# EAGLE design mains_relay_modem (EAGLE 7.5.0)
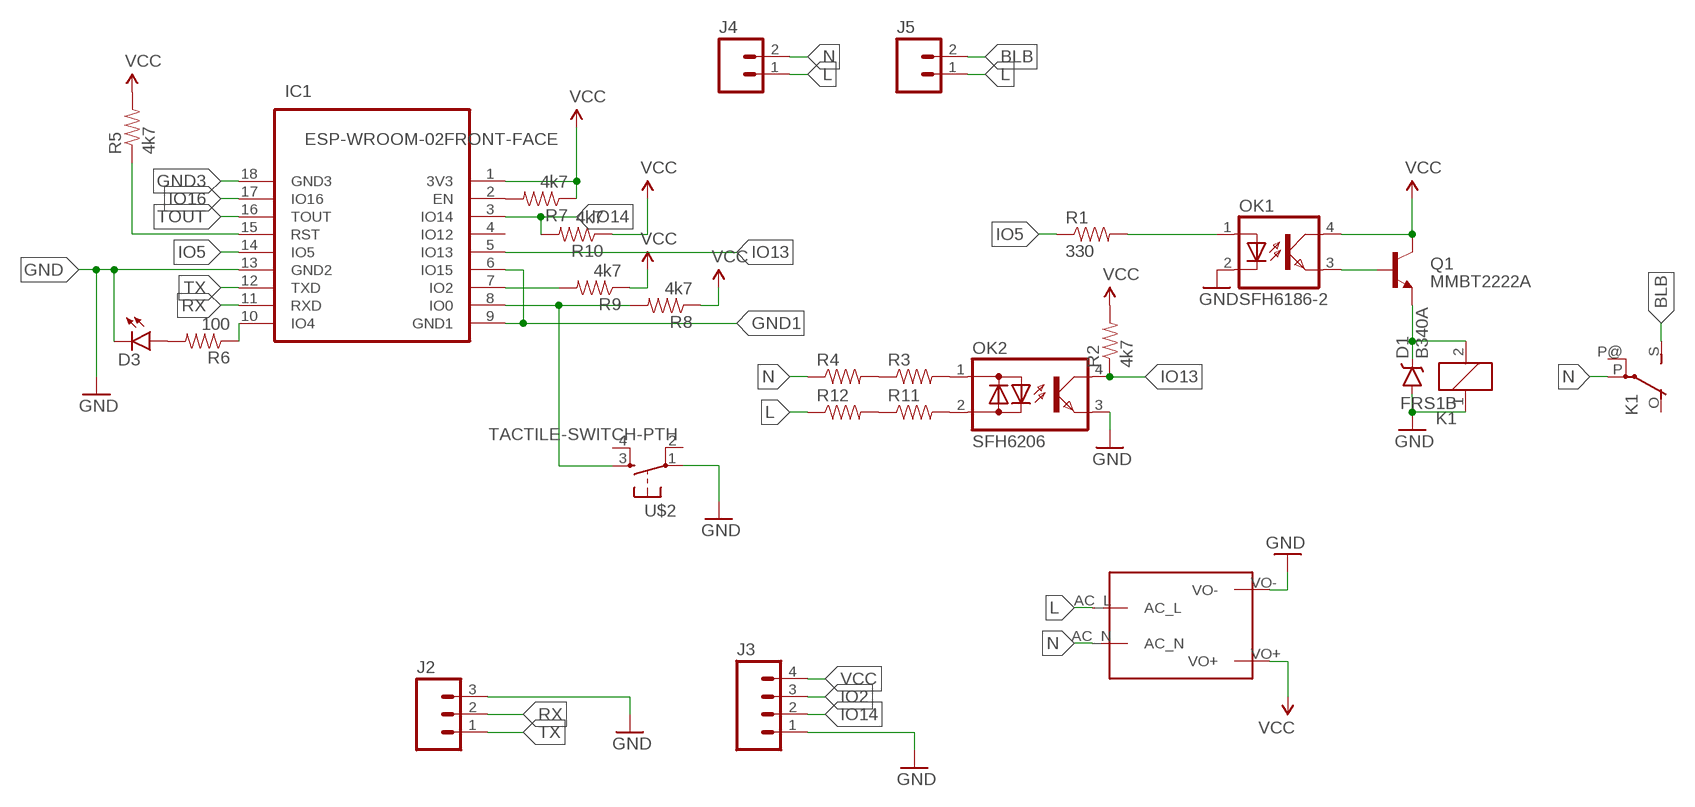
[diagram p0: schematic, sheet 1]

## Parts
D1  B340A  DIODE-SCHOTTKY-B340A  [SMA-DIODE]
D3  LED3MM  [LED3MM]
IC1  ESP-WROOM-02FRONT-FACE  [FRONT-FACE]
J2  M03PTH  [1X03]
J3  M04NO_SILK_ALL_ROUND  [1X04_NO_SILK_ALL_ROUND]
J4  M025MM  [SCREWTERMINAL-5MM-2]
J5  M025MM  [SCREWTERMINAL-5MM-2]
K1  FRS1B  [FRS1B]
OK1  SFH6186-2  [SMD4]
OK2  SFH6206  [DIL4-SMD]
Q1  MMBT2222A  TRANSISTOR_NPNMMBT2222A  [SOT23-3]
R1  330  RESISTOR0805-RES  [0805]
R2  4k7  RESISTOR0805-RES  [0805]
R3  RESISTOR0805-RES  [0805]
R4  RESISTOR0805-RES  [0805]
R5  4k7  RESISTOR0805-RES  [0805]
R6  100  RESISTOR0805-RES  [0805]
R7  4k7  RESISTOR0805-RES  [0805]
R8  4k7  RESISTOR0805-RES  [0805]
R9  4k7  RESISTOR0805-RES  [0805]
R10  4k7  RESISTOR0805-RES  [0805]
R11  RESISTOR0805-RES  [0805]
R12  RESISTOR0805-RES  [0805]
U$1  MAINS_CONVERTERS  [HLK-PM01]
U$2  TACTILE-SWITCH-PTH  [TAC-SWITCH-PTH]

## Nets
BLB: J5.2 K1.S(2:S)
GND: D1.A D3.K(C) IC1.13(GND2) J2.3 J3.1 K1.1 OK1.2(C) OK2.3(E) U$1.VO- U$2.1
GND1: IC1.6(IO15) IC1.9(GND1)
GND3: IC1.18(GND3)
IO2: IC1.7(IO2) J3.3 R9.2
IO5: IC1.14(IO5) R1.1
IO13: IC1.5(IO13) OK2.4(C) R2.1
IO14: IC1.3(IO14) J3.2 R10.2
IO16: IC1.17(IO16)
L: J4.1 J5.1 R12.1 U$1.AC_L
N: J4.2 K1.P(2:P) R4.1 U$1.AC_N
N$1: IC1.10(IO4) R6.1
N$2: D3.A R6.2
N$3: IC1.2(EN) R7.2
N$4: D1.C K1.2 Q1.2(E)
N$5: OK2.1(AC1) R3.2
N$6: R3.1 R4.2
N$7: OK1.1(A) R1.2
N$8: OK1.3(EMIT) Q1.1(B)
N$9: OK2.2(AC2) R11.2
N$10: IC1.15(RST) R5.1
N$11: IC1.8(IO0) R8.2 U$2.3
N$12: R11.1 R12.2
RX: IC1.11(RXD) J2.2
TOUT: IC1.16(TOUT)
TX: IC1.12(TXD) J2.1
VCC: IC1.1(3V3) J3.4 OK1.4(COL) Q1.3(C) R2.2 R5.2 R7.1 R8.1 R9.1 R10.1 U$1.VO+
Unconnected: IC1.4(IO12) K1.O(2:O) K1.P@(2:P) U$2.2 U$2.4

## Library data of the parts
D1 = SparkFun-DiscreteSemi:DIODE-SCHOTTKY: Schottky diodes in SFE's production catalog BAT20J 1A 23V 0.62Vf RB751 120mA 40V 0.37Vf PMEG4005EJ 0.5A 40V 0.42Vf MBRA140 1A 40V 0.5Vf B340A 3A 40V SMA; PROD_ID: DIO-09886
D3 = SparkFun-LED:LED: LEDs Standard schematic elements and footprints for 5mm, 3mm, 1206, and 0603 sized LEDs. 5mm - Spark Fun Electronics SKU : COM-00529 (and others); PROD_ID: DIO-08794
IC1 = esp-wroom-02:ESP-WROOM-02: WiFi module - ESP-WROOM-02
J2 = SparkFun-Connectors:M03: Header 3 Standard 3-pin 0.1" header. Use with straight break away headers (SKU : PRT-00116), right angle break away headers (PRT-00553), swiss pins (PRT-00743), machine pins (PRT-00117), and female headers (PRT-00115). Molex polarized connector foot print use with SKU : PRT-08232 with associated crimp pins and housings.
J3 = SparkFun-Connectors:M04: Header 4 Standard 4-pin 0.1" header. Use with straight break away headers (SKU : PRT-00116), right angle break away headers (PRT-00553), swiss pins (PRT-00743), machine pins (PRT-00117), and female headers (PRT-00115). Molex polarized connector foot print use with SKU : PRT-08231 with associated crimp pins and housings. 1MM SMD Version SKU: PRT-10208; PROD_ID: CONN-09696
J4 J5 = SparkFun-Connectors:M02: Standard 2-pin 0.1" header. Use with - straight break away headers ( PRT-00116) - right angle break away headers (PRT-00553) - swiss pins (PRT-00743) - machine pins (PRT-00117) - female headers (PRT-00115) Molex polarized connector foot print use with: PRT-08233 with associated crimp pins and housings. 2.54_SCREWTERM for use with PRT-10571. 3.5mm Screw Terminal footprints for PRT-08084 5mm Screw Terminal footprints for use with PRT-08432; STOREFRONT_ID: PRT-08432
K1 = relay:FRS1B: RELAY 1 x switch, same as V23101-D6-A201, Siemens; OC_FARNELL: unknown; OC_NEWARK: unknown
OK1 = optodevices:SFH618?*: Optocoupler, Phototransistor Output, Low Input Current Source: http://www.vishay.com/docs/83673/sfh618.pdf
OK2 = optodevices:SFH620: Optocoupler, Phototransistor Output, AC Input Source: http://www.vishay.com/docs/83675/sfh620.pdf
Q1 = SparkFun-DiscreteSemi:TRANSISTOR_NPN: Generic NPN BJT MMBT2222A - TRANS-08049 (SOT-23, 1A 40V) MPSA42 - TRANS-09116 (SOT-23, 500mA 300V) MMBT5088LT1G - TRANS-11160 (SOT-23, 50 mA 30V) BC547 - COM-08928 <http://www.sparkfun.com/products/8928> (TO-92 45V 100mA) (1.Collector 2.Base 3.Emitter) 2N3904 - COM-00521 <http://www.sparkfun.com/products/521> (TO-92 40V 200mA) (1.Emitter 2.Base 3.Collector) P2N2222A - COM-12852 <http://www.sparkfun.com/products/12852> (TO-92 40V 600mA) (1.Collector 2.Base 3.Emitter); PROD_ID: TRANS-08049
R1-R12 = SparkFun-Passives:RESISTOR: Resistor Basic schematic elements and footprints for 0603, 1206, and PTH resistors.
U$1 = captain-slow:MAINS_CONVERTERS
U$2 = GeekAmmo:TACTILE-SWITCH: Tactile Switch 4 Pins, SPST NO

## Board
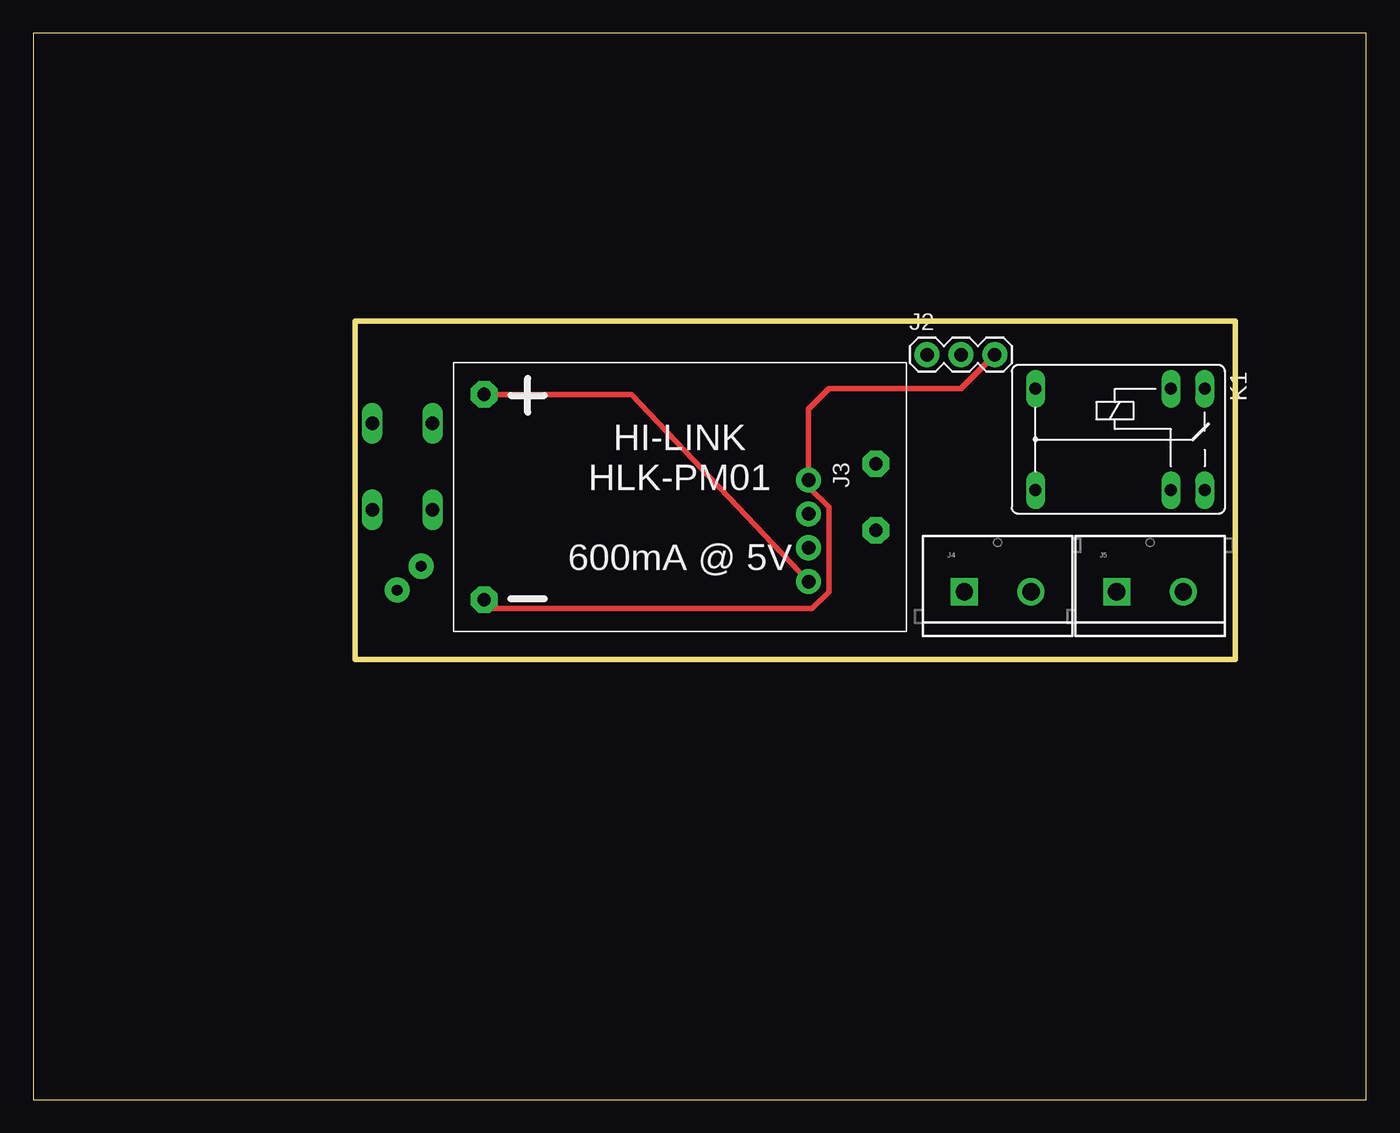
[diagram p1: board, top side]
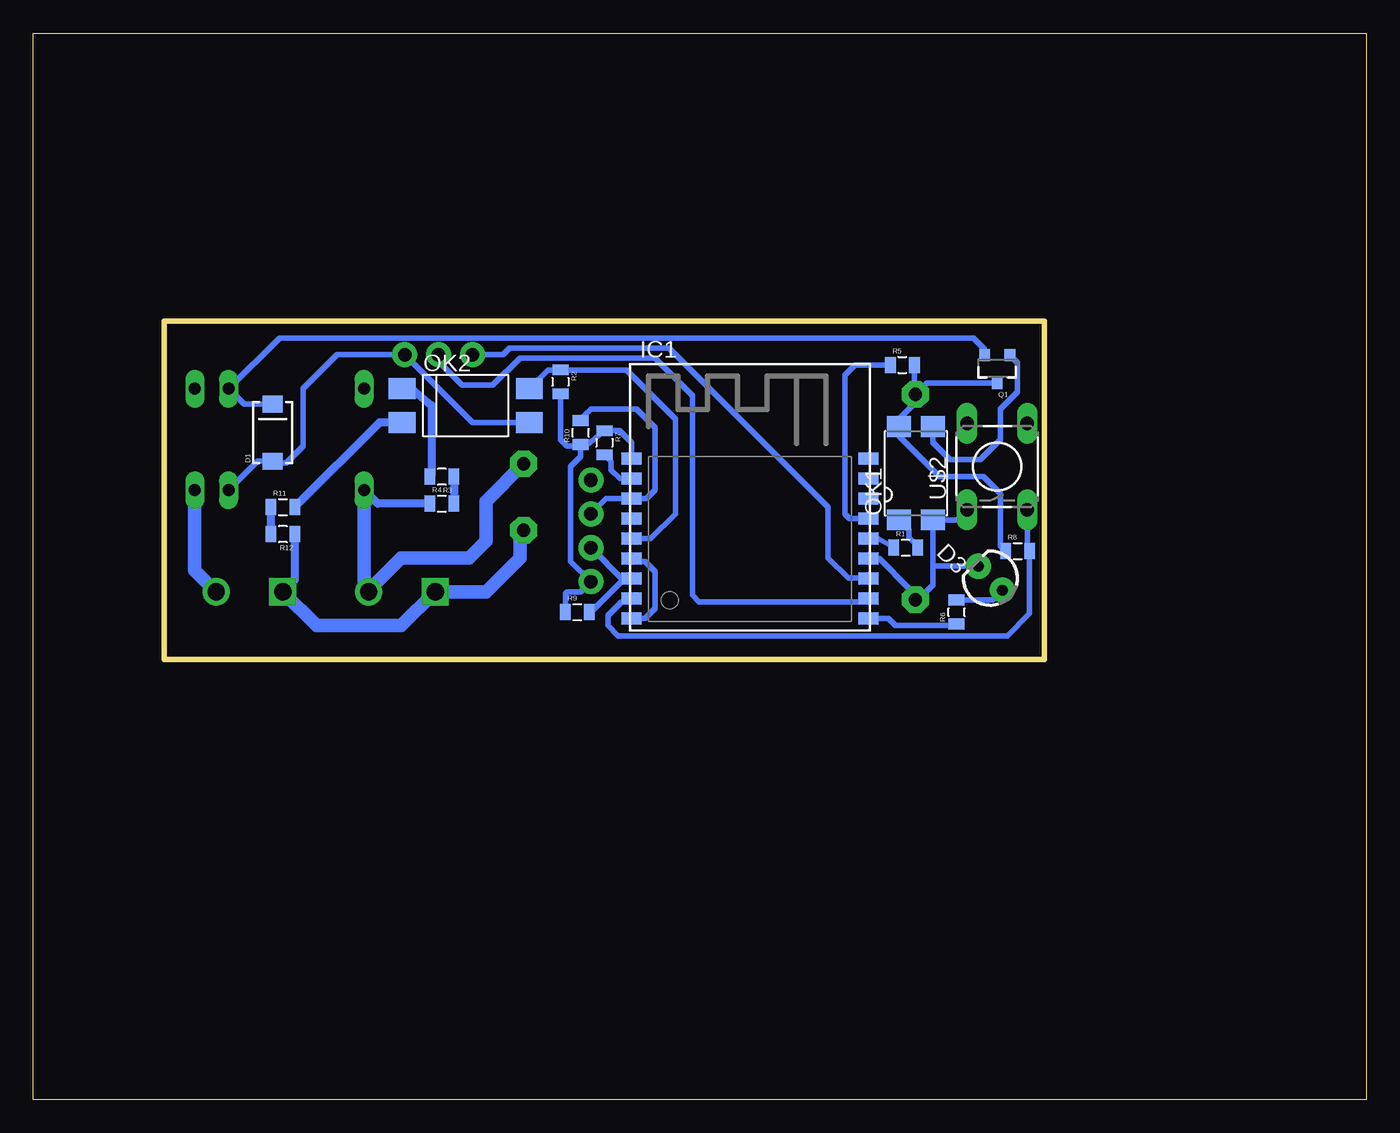
[diagram p2: board, bottom side, seen from below]

Size 100 x 80 mm. Coordinates in mm from the lower left corner, seen from the top.
Outline: 0,0 100,0 100,80 0,80 0,0
Outline: 90.17,58.42 90.17,33.02 24.13,33.02 24.13,58.42 90.17,58.42
Copper layers (1*16): Top 0.035mm / dielectric 1.5mm / Bottom 0.035mm
Design rules "default": minimum track width 10mil, minimum drill 24mil, track to track 8mil, track to pad 8mil, pad to pad 8mil, via to via 8mil, smd to smd 8mil, copper to edge 40mil, drill to drill 8mil, minimum pad ring 10mil, minimum via ring 8mil, stop-mask expansion 4mil, vias tented up to drill 0mil, thermal gap 10mil

### Footprints (pad centres in the part's own frame; a part is rotated, then mirrored left to right if it is on the bottom)
SMA-DIODE = smd 1.27 x 1.47: A -2.15,0; C 2.15,0
LED3MM = drill 0.813 pad 1.88: A -1.27,0; K 1.27,0
FRONT-FACE = smd 1.485 x 0.9: 1 -8.893,4.9; 2 -8.893,3.4; 3 -8.893,1.9; 4 -8.893,0.4; 5 -8.893,-1.1; 6 -8.893,-2.6; 7 -8.893,-4.1; 8 -8.893,-5.6; 9 -8.893,-7.1; 10 8.893,-7.1; 11 8.893,-5.6; 12 8.893,-4.1; 13 8.893,-2.6; 14 8.893,-1.1; 15 8.893,0.4; 16 8.893,1.9; 17 8.893,3.4; 18 8.893,4.9
1X03 = drill 1.016 pad 1.88: 1 0,0; 2 2.54,0; 3 5.08,0
1X04_NO_SILK_ALL_ROUND = drill 1.016 pad 1.88: 1 0,0; 2 2.54,0; 3 5.08,0; 4 7.62,0
SCREWTERMINAL-5MM-2 = drill 1.3 pad 2.032 square: 1 0,0 | drill 1.3 pad 2.032: 2 5,0
FRS1B = drill 0.914 long: 1 0,3.81; 2 0,-3.81; O -2.54,-3.81; P 10.16,3.81; P@ 10.16,-3.81; S -2.54,3.81
SMD4 = smd 1.78 x 1.55: 1 -1.27,-3.5; 2 1.27,-3.5; 3 1.27,3.5; 4 -1.27,3.5
DIL4-SMD = smd 1.6 x 2: 1 -1.27,-4.77; 2 1.27,-4.77; 3 1.27,4.77; 4 -1.27,4.77
SOT23-3 = smd 0.8 x 0.9: 1 -0.95,-1; 2 0.95,-1; 3 0,1.1
0805 = smd 0.8 x 1.2: 1 -0.9,0; 2 0.9,0
HLK-PM01 = drill 1 pad 2 octagon: AC_L -14.7,2.5; AC_N -14.7,-2.5; VO+ 14.7,-7.7; VO- 14.7,7.7
TAC-SWITCH-PTH = drill 1.016 pad 1.524 long: 1 -3.251,2.261; 2 3.251,2.261; 3 -3.251,-2.261; 4 3.251,-2.261

### Placement (x,y rotation side)
D1  82.04,50.04 90 bottom
D3  28.19,39.12 135 bottom
IC1  46.23,43.18 0 bottom
J2  67.06,55.88 0 top
J3  58.17,46.48 270 top
J4  69.85,38.1 0 top
J5  81.28,38.1 0 top
K1  85.34,49.53 180 top
OK1  33.78,46.99 0 bottom
OK2  67.56,52.07 270 bottom
Q1  27.69,54.86 180 bottom
R1  34.54,41.4 0 bottom
R2  60.45,53.85 270 bottom
R3  69.34,46.74 180 bottom
R4  69.34,44.7 0 bottom
R5  34.8,55.12 0 bottom
R6  30.73,36.58 90 bottom
R7  57.15,49.28 270 bottom
R8  26.16,41.15 0 bottom
R9  59.18,36.58 0 bottom
R10  58.93,50.04 90 bottom
R11  81.28,44.45 0 bottom
R12  81.28,42.42 180 bottom
U$1  48.51,45.21 180 top
U$2  27.69,47.5 90 bottom

### Tracks (layer width: path | path; a pad name or v marks a point on that pad's centre or on a via)
BLB
  Bottom 1.016: K1.S 87.88,39.7 J5.2
GND
  Top 0.406: U$1.VO- 34.5,36.83 58.42,36.83 59.69,38.1 59.69,44.45 58.17,45.97 J3.1 58.17,51.82 59.69,53.34 69.6,53.34 J2.3
  Bottom 0.406: K1.1 83.18,47.89 D1.A 81.91,47.75 81.03,47.75 79.76,49.02 79.76,53.34 77.22,55.88 J2.3 67.06,50.8 OK2.3 | IC1.13 36.52,40.58 34.29,38.35 34.29,37.99 U$1.VO- 33.61,37.51 32.51,38.61 32.51,40.13 | 32.51,40.13 OK1.2 30.7,43.49 U$2.1 | D3.K 32.39,40.01 32.51,40.13
GND1
  Bottom 0.406: IC1.9 54.09,36.08 53.34,36.83 53.34,39.62 54.1,40.39 54.93,40.39 IC1.6
IO2
  Bottom 0.406: R9.2 58.17,36.58 55.75,38.99 | 55.75,38.99 55.63,39.12 55.16,39.12 IC1.7 | J3.3 55.75,38.99
IO5
  Bottom 0.406: IC1.14 36.63,42.08 R1.1
IO13
  Bottom 0.406: IC1.5 53.68,42.08 51.82,43.94 51.82,51.05 55.51,54.75 R2.1 61.39,54.75 OK2.4
IO14
  Bottom 0.406: J3.2 57.03,45.08 IC1.3 53.98,45.08 53.34,45.72 53.34,50.43 54.73,51.82 58.17,51.82 58.67,51.31 R10.2
L
  Bottom 0.61: R12.1 80.38,39 J5.1
  Bottom 1.016: U$1.AC_L 63.5,42.43 63.5,40.64 66.04,38.1 J4.1 72.39,35.56 78.74,35.56 J5.1
N
  Bottom 0.406: J4.2 74.85,38.18
  Bottom 0.61: R4.1 74.17,44.7 K1.P
  Bottom 1.016: 74.85,38.18 72.39,40.64 67.31,40.64 66.04,41.91 66.04,44.89 U$1.AC_N | K1.P 75.18,38.43 J4.2
N$1
  Bottom 0.406: IC1.10 35.83,36.08 35.31,35.56 30.85,35.56 R6.1
N$2
  Bottom 0.406: R6.2 28.04,37.48 D3.A
N$3
  Bottom 0.406: IC1.2 55.98,46.58 56.64,47.24 56.64,47.87 R7.2
N$4
  Bottom 0.406: D1.C 84.19,52.19 K1.2 81.53,57.15 29.46,57.15 28.64,56.32 Q1.2
N$5
  Bottom 0.406: OK2.1 71.63,53.34 | 70.1,46.87 R3.2
  Bottom 0.61: 71.63,53.34 70.1,52.07 70.1,46.87
N$6
  Bottom 0.61: R3.1 R4.2
N$7
  Bottom 0.406: R1.2 33.64,41.52 34.29,42.16 34.29,42.73 OK1.1
N$8
  Bottom 0.406: OK1.3 32.51,49.28 31.24,48.01 28.96,48.01 27.43,49.53 27.43,51.82 26.16,53.09 26.16,55.29 Q1.1
N$9
  Bottom 0.61: OK2.2 74.03,50.8 R11.2
N$10
  Bottom 0.406: IC1.15 38.75,43.58 39.12,43.94 39.12,54.36 38.35,55.12 R5.1
N$11
  Bottom 0.406: U$2.3 25.43,41.31 R8.2 25.26,36.46 26.92,34.8 56.13,34.8 56.9,35.56 56.9,36.32 55.88,37.34 55.36,37.34 IC1.8
N$12
  Bottom 0.61: R11.1 R12.2
RX
  Bottom 0.406: J2.2 69.6,55.37 67.82,53.59 65.53,53.59 63.5,55.63 53.34,55.63 50.55,52.83 50.55,37.85 50.04,37.34 37.58,37.34 IC1.11
TX
  Bottom 0.406: J2.1 64.77,55.88 64.26,56.39 52.32,56.39 40.39,44.45 40.39,40.64 38.86,39.12 37.37,39.12 IC1.12
VCC
  Top 0.406: U$1.VO+ 44.88,52.91 J3.4
  Bottom 0.406: R10.1 58.67,48.91 R7.1 56.02,50.18 55.12,49.28 IC1.1 | R9.1 60.08,37.96 59.94,38.1 58.93,38.1 J3.4 59.69,40.39 59.69,47.5 58.93,48.26 R10.1 | U$1.VO+ 33.78,52.88 33.78,52.32 35.05,51.05 OK1.4 35.05,49.78 32,46.74 28.7,46.74 27.43,45.47 27.43,41.52 R8.1 | R2.2 60.45,49.53 59.94,49.02 59.04,49.02 R10.1 | R5.2 33.9,53 U$1.VO+ | Q1.3 32.96,53.76 U$1.VO+